# EAGLE design gy1 (EAGLE 9.2.2)

## Sheet 1 of 4
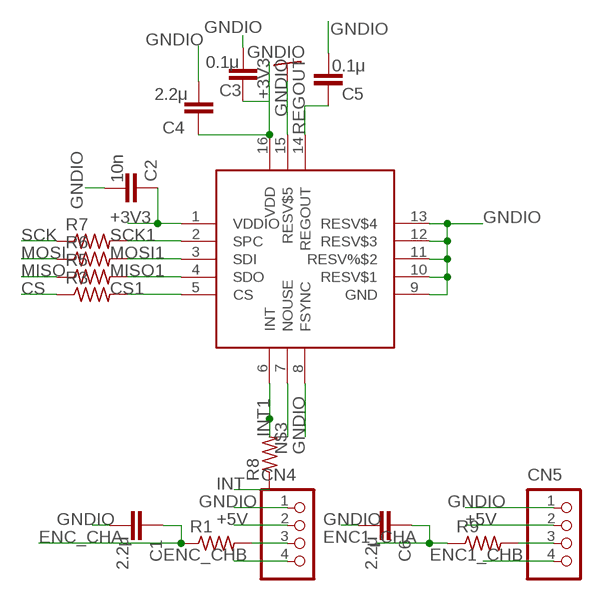
[diagram p0: schematic, sheet 1]

### Parts
C1  2.2μ  C-EUC0603  [C0603]
C2  10n  C-EUC0603  [C0603]
C3  0.1μ  C-EUC0603  [C0603]
C4  2.2μ  C-EUC0603  [C0603]
C5  0.1μ  C-EUC0603  [C0603]
C6  2.2μ  C-EUC0603  [C0603]
CN4  S4B-XASK-1  [S4B-XASK-1]
CN5  S4B-XASK-1  [S4B-XASK-1]
R1  R-US_R0603  [R0603]
R3  R-US_R0603  [R0603]
R5  R-US_R0603  [R0603]
R6  R-US_R0603  [R0603]
R7  R-US_R0603  [R0603]
R8  R-US_R0603  [R0603]
R9  R-US_R0603  [R0603]
U$1  ICM20602  [QFN50P300X300X80-16N]

### Nets
+3V3: C2.1 C3.1 C4.1 U$1.1(VDDIO) U$1.16(VDD) ; also sheet 2,3
+5V: CN4.2 CN5.2 ; also sheet 2,3,4
CS: R3.1 ; also sheet 2
CS1: R3.2 U$1.5(CS)
ENC1_CHA: C6.1 R9.1 ; also sheet 2
ENC1_CHB: CN5.4 ; also sheet 2
ENC_CHA: C1.1 R1.1 ; also sheet 2
ENC_CHB: CN4.4 ; also sheet 2
GNDIO: C1.2 C2.2 C3.2 C4.2 C5.2 C6.2 CN4.1 CN5.1 U$1.8(FSYNC) U$1.9(GND) U$1.10(RESV$1) U$1.11(RESV%$2) U$1.12(RESV$3) U$1.13(RESV$4) U$1.15(RESV$5) ; also sheet 2,3,4
INT: R8.1
INT1: R8.2 U$1.6(INT)
MISO: R5.1 ; also sheet 2
MISO1: R5.2 U$1.4(SDO)
MOSI: R6.1 ; also sheet 2
MOSI1: R6.2 U$1.3(SDI)
N$3: U$1.7(NOUSE)
N$4: CN4.3 R1.2
N$5: CN5.3 R9.2
REGOUT: C5.1 U$1.14(REGOUT)
SCK: R7.1 ; also sheet 2
SCK1: R7.2 U$1.2(SPC)

## Sheet 2 of 4
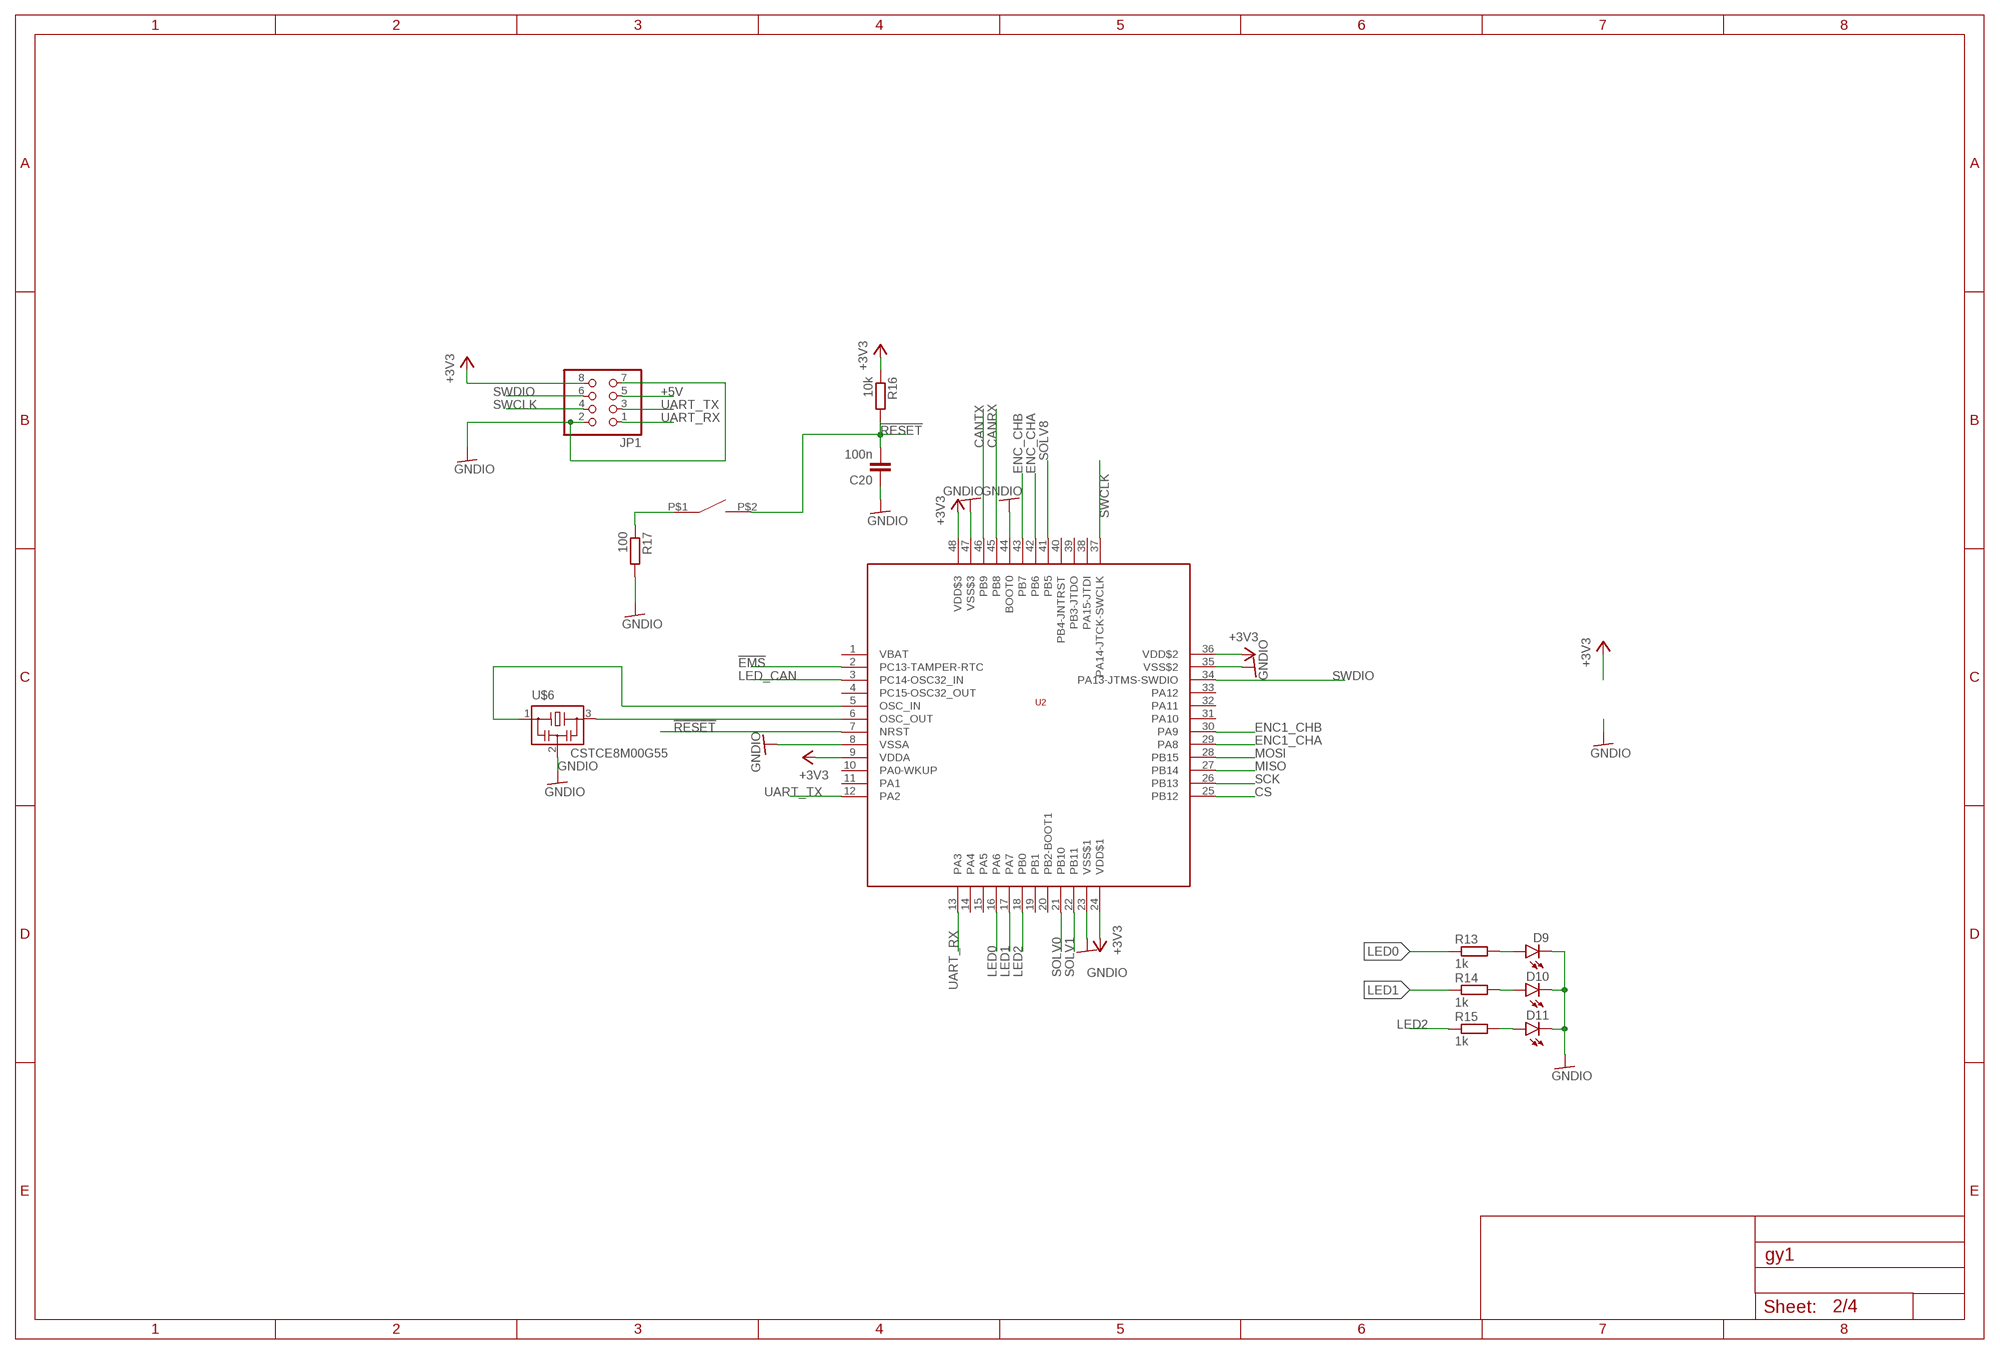
[diagram p1: schematic, sheet 2]

### Parts
C20  100n  C-EUC0603  [C0603]
D9  LEDCHIPLED_0805  [CHIPLED_0805]
D10  LEDCHIPLED_0805  [CHIPLED_0805]
D11  LEDCHIPLED_0805  [CHIPLED_0805]
JP1  PINHD-2X4  [2X04]
R13  1k  R-EU_R0603  [R0603]
R14  1k  R-EU_R0603  [R0603]
R15  1k  R-EU_R0603  [R0603]
R16  10k  R-EU_R0603  [R0603]
R17  100  R-EU_R0603  [R0603]
SW1  SWITCH_TACTILETOP  [SWITCH_TACTILE_3X6]
U2  STM32F103C8  [LQFP48]
U$6  CSTCE8M00G55  [CSTCE8M00G55]

### Nets
!EMS: U2.2(PC13-TAMPER-RTC)
!RESET: C20.2 R16.2 SW1.P$2 U2.7(NRST)
+3V3: JP1.8 R16.1 U2.9(VDDA) U2.24(VDD$1) U2.36(VDD$2) U2.48(VDD$3) ; also sheet 1,3
+5V: JP1.5 ; also sheet 1,3,4
CANRX: U2.45(PB8) ; also sheet 4
CANTX: U2.46(PB9) ; also sheet 4
CS: U2.25(PB12) ; also sheet 1
ENC1_CHA: U2.29(PA8) ; also sheet 1
ENC1_CHB: U2.30(PA9) ; also sheet 1
ENC_CHA: U2.42(PB6) ; also sheet 1
ENC_CHB: U2.43(PB7) ; also sheet 1
GNDIO: C20.1 D9.C D10.C D11.C JP1.2 JP1.7 R17.2 U2.8(VSSA) U2.23(VSS$1) U2.35(VSS$2) U2.44(BOOT0) U2.47(VSS$3) U$6.2 ; also sheet 1,3,4
LED0: R13.1 U2.16(PA6)
LED1: R14.1 U2.17(PA7)
LED2: R15.1 U2.18(PB0)
LED_CAN: U2.3(PC14-OSC32_IN) ; also sheet 4
MISO: U2.27(PB14) ; also sheet 1
MOSI: U2.28(PB15) ; also sheet 1
N$2: D10.A R14.2
N$10: D9.A R13.2
N$11: U2.6(OSC_OUT) U$6.3
N$16: R17.1 SW1.P$1
N$19: U2.5(OSC_IN) U$6.1
N$21: D11.A R15.2
SCK: U2.26(PB13) ; also sheet 1
SOLV0: U2.21(PB10)
SOLV1: U2.22(PB11)
SOLV8: U2.41(PB5)
SWCLK: JP1.4 U2.37(PA14-JTCK-SWCLK)
SWDIO: JP1.6 U2.34(PA13-JTMS-SWDIO)
UART_RX: JP1.1 U2.13(PA3)
UART_TX: JP1.3 U2.12(PA2)
Unconnected: U2.1(VBAT) U2.4(PC15-OSC32_OUT) U2.10(PA0-WKUP) U2.11(PA1) U2.14(PA4) U2.15(PA5) U2.19(PB1) U2.20(PB2-BOOT1) U2.31(PA10) U2.32(PA11) U2.33(PA12) U2.38(PA15-JTDI) U2.39(PB3-JTDO) U2.40(PB4-JNTRST)

## Sheet 3 of 4
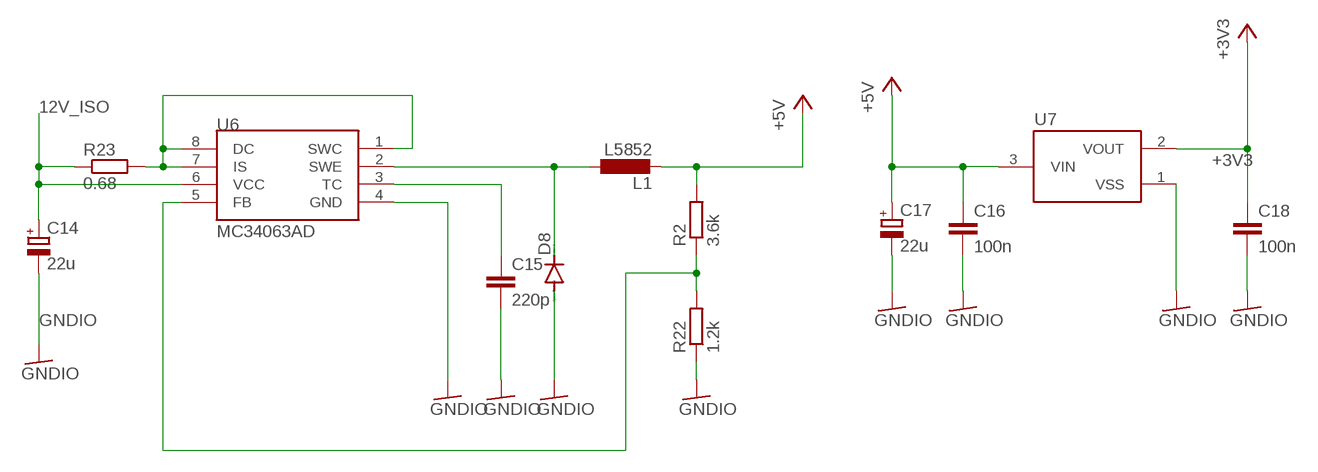
[diagram p2: schematic, sheet 3]

### Parts
C14  22u  CPOL-EUE2-5  [E2-5]
C15  220p  C-EUC0603  [C0603]
C16  100n  C-EUC0603  [C0603]
C17  22u  CPOL-EUE2-5  [E2-5]
C18  100n  C-EUC0603  [C0603]
D8  DIODE-SOD123  [SOD123]
L1  L5852  [L5852]
R2  3.6k  R-EU_R0603  [R0603]
R22  1.2k  R-EU_R0603  [R0603]
R23  0.68  R-EU_R1206  [R1206]
U6  MC34063AD  [SOIC8]
U7  XC6206  [SOT95P240X110-3]

### Nets
12V_ISO: C14.+ R23.1 U6.6(VCC) ; also sheet 4
+3V3: C18.1 U7.2(VOUT) ; also sheet 1,2
+5V: C16.1 C17.+ L1.P$2 R2.2 U7.3(VIN) ; also sheet 1,2,4
GNDIO: C14.- C15.2 C16.2 C17.- C18.2 D8.A R22.1 U6.4(GND) U7.1(VSS) ; also sheet 1,2,4
N$22: R23.2 U6.1(SWC) U6.7(IS) U6.8(DC)
N$24: D8.C L1.P$1 U6.2(SWE)
N$25: C15.1 U6.3(TC)
N$26: R2.1 R22.2 U6.5(FB)

## Sheet 4 of 4
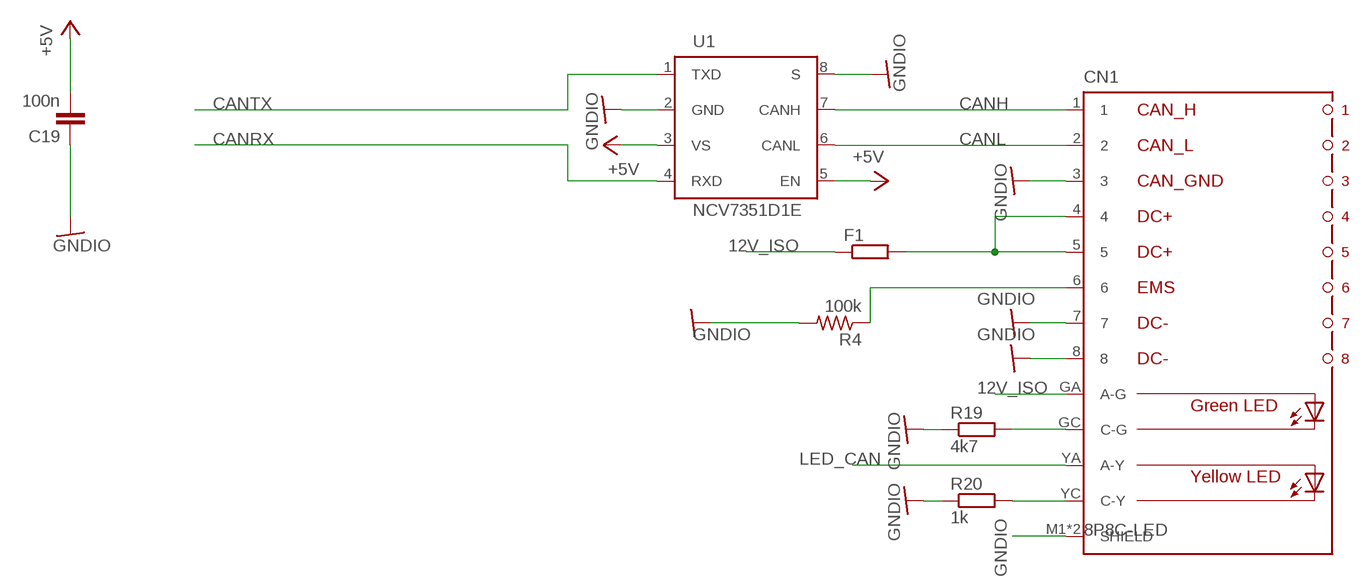
[diagram p3: schematic, sheet 4]

### Parts
C19  100n  C-EUC0603  [C0603]
CN1  8P8C-LED  [8P8C-LED]
F1  R-EU_R1206  [R1206]
R4  100k  R-US_R0603  [R0603]
R19  4k7  R-EU_R0603  [R0603]
R20  1k  R-EU_R0603  [R0603]
U1  NCV7351D1E  [SO08]

### Nets
12V_ISO: CN1.GA(A-G) F1.1 ; also sheet 3
+5V: C19.2 U1.3(VS) U1.5(EN) ; also sheet 1,2,3
CANH: CN1.1 U1.7(CANH)
CANL: CN1.2 U1.6(CANL)
CANRX: U1.4(RXD) ; also sheet 2
CANTX: U1.1(TXD) ; also sheet 2
GNDIO: C19.1 CN1.3 CN1.7 CN1.8 CN1.M1(SHIELD) CN1.M2(SHIELD) R4.2 R19.1 R20.1 U1.2(GND) U1.8(S) ; also sheet 1,2,3
LED_CAN: CN1.YA(A-Y) ; also sheet 2
N$1: CN1.GC(C-G) R19.2
N$12: CN1.4 CN1.5 F1.2
N$18: CN1.YC(C-Y) R20.2
N$38: CN1.6 R4.1

## Library data of the parts
C1-C6 C16 C18-C20 = rcl:C-EU: CAPACITOR, European symbol
C14 C17 = rcl:CPOL-EU: POLARIZED CAPACITOR, European symbol
C15 = rcl:C-EU: CAPACITOR, European symbol; SPICEPREFIX: C
CN1 = con-rj45:8P8C-LED: generic 8P8C connector with two LED's; OC_FARNELL: unknown; OC_NEWARK: unknown
CN4 CN5 = jst-xa:S4B-XASK-1: Wire-to-Board 2.5mm pitch top mount connector Source: http://www.jst-mfg.com/product/pdf/jpn/XA1.pdf http://www.jst-mfg.com/product/detail.php?series=272
D8 = diode:DIODE-: DIODE
D9-D11 = led:LED: LED OSRAM: - CHIPLED LG R971, LG N971, LY N971, LG Q971, LY Q971, LO R971, LY R971 LH N974, LH R974 LS Q976, LO Q976, LY Q976 LO Q996 - Hyper CHIPLED LW Q18S LB Q993, LB Q99A, LB R99A - SideLED LS A670, LO A670, LY A670, LG A670, LP A670 LB A673, LV A673, LT A673, LW A673 LH A674 LY A675 LS A676, LA A676, LO A676, LY A676, LW A676 LS A679, LY A679, LG A679 - Hyper Micro SIDELED® LS Y876, LA Y876, LO Y876, LY Y876 LT Y87S - SmartLED LW L88C, LW L88S LB L89C, LB L89S, LG L890 LS L89K, LO L89K, LY L89K LS L896, LA L896, LO L896, LY L896 - TOPLED LS T670, LO T670, LY T670, LG T670, LP T670 LSG T670, LSP T670, LSY T670, LOP T670, LYG T670 LG T671, LOG T671, LSG T671 LB T673, LV T673, LT T673, LW T673 LH T674 LS T676, LA T676, LO T676, LY T676, LB T676, LH T676, LSB T676, LW T676 LB T67C, LV T67C, LT T67C, LS T67K, LO T67K, LY T67K, LW E67C LS E67B, LA E67B, LO E67B, LY E67B, LB E67C, LV E67C, LT E67C LW T67C LS T679, LY T679, LG T679 LS T770, LO T770, LY T770, LG T770, LP T770 LB T773, LV T773, LT T773, LW T773 LH T774 LS E675, LA E675, LY E675, LS T675 LS T776, LA T776, LO T776, LY T776, LB T776 LHGB T686 LT T68C, LB T68C - Hyper Mini TOPLED® LB M676 - Mini TOPLED Santana® LG M470 LS M47K, LO M47K, LY M47K Source: http://www.osram.convergy.de LUXEON: - LUMILED® LXK2-PW12-R00, LXK2-PW12-S00, LXK2-PW14-U00, LXK2-PW14-V00 LXK2-PM12-R00, LXK2-PM12-S00, LXK2-PM14-U00 LXK2-PE12-Q00, LXK2-PE12-R00, LXK2-PE12-S00, LXK2-PE14-T00, LXK2-PE14-U00 LXK2-PB12-K00, LXK2-PB12-L00, LXK2-PB12-M00, LXK2-PB14-N00, LXK2-PB14-P00, LXK2-PB14-Q00 LXK2-PR12-L00, LXK2-PR12-M00, LXK2-PR14-Q00, LXK2-PR14-R00 LXK2-PD12-Q00, LXK2-PD12-R00, LXK2-PD12-S00 LXK2-PH12-R00, LXK2-PH12-S00 LXK2-PL12-P00, LXK2-PL12-Q00, LXK2-PL12-R00 Source: www.luxeon.com KINGBRIGHT: KA-3528ASYC Source: www.kingbright.com
F1 R2 R19 R20 R22 R23 = rcl:R-EU_: RESISTOR, European symbol; SPICEPREFIX: R
JP1 = pinhead:PINHD-2X4: PIN HEADER
L1 = l_ysk:L5852
R1 R3-R9 = rcl:R-US_: RESISTOR, American symbol; SPICEPREFIX: R
R13-R17 = rcl:R-EU_: RESISTOR, European symbol
SW1 = switch-tactile:SWITCH_TACTILE
U1 = on-semi:NCV7351D1E: High Speed CAN Transceiver Source: NCV7351-D.PDF <http://www.onsemi.com/PowerSolutions/document/NCV7351-D.PDF>
U2 = stm32_mcu:STM32F103C8: STMicroelectronics STM32F103C8 Mainstream Performance line, ARM Cortex-M3 MCU with 64 Kbytes Flash, 72 MHz CPU, motor control, USB and CAN references: datasheet <https://www.st.com/resource/en/datasheet/stm32f103c8.pdf> product page <https://www.st.com/ja/microcontrollers/stm32f103c8.html>
U6 = mc34063:MC34063
U7 = torex:XC6206
U$1 = ICM20602:ICM20602
U$6 = resonator:CSTCE8M00G55

## Board
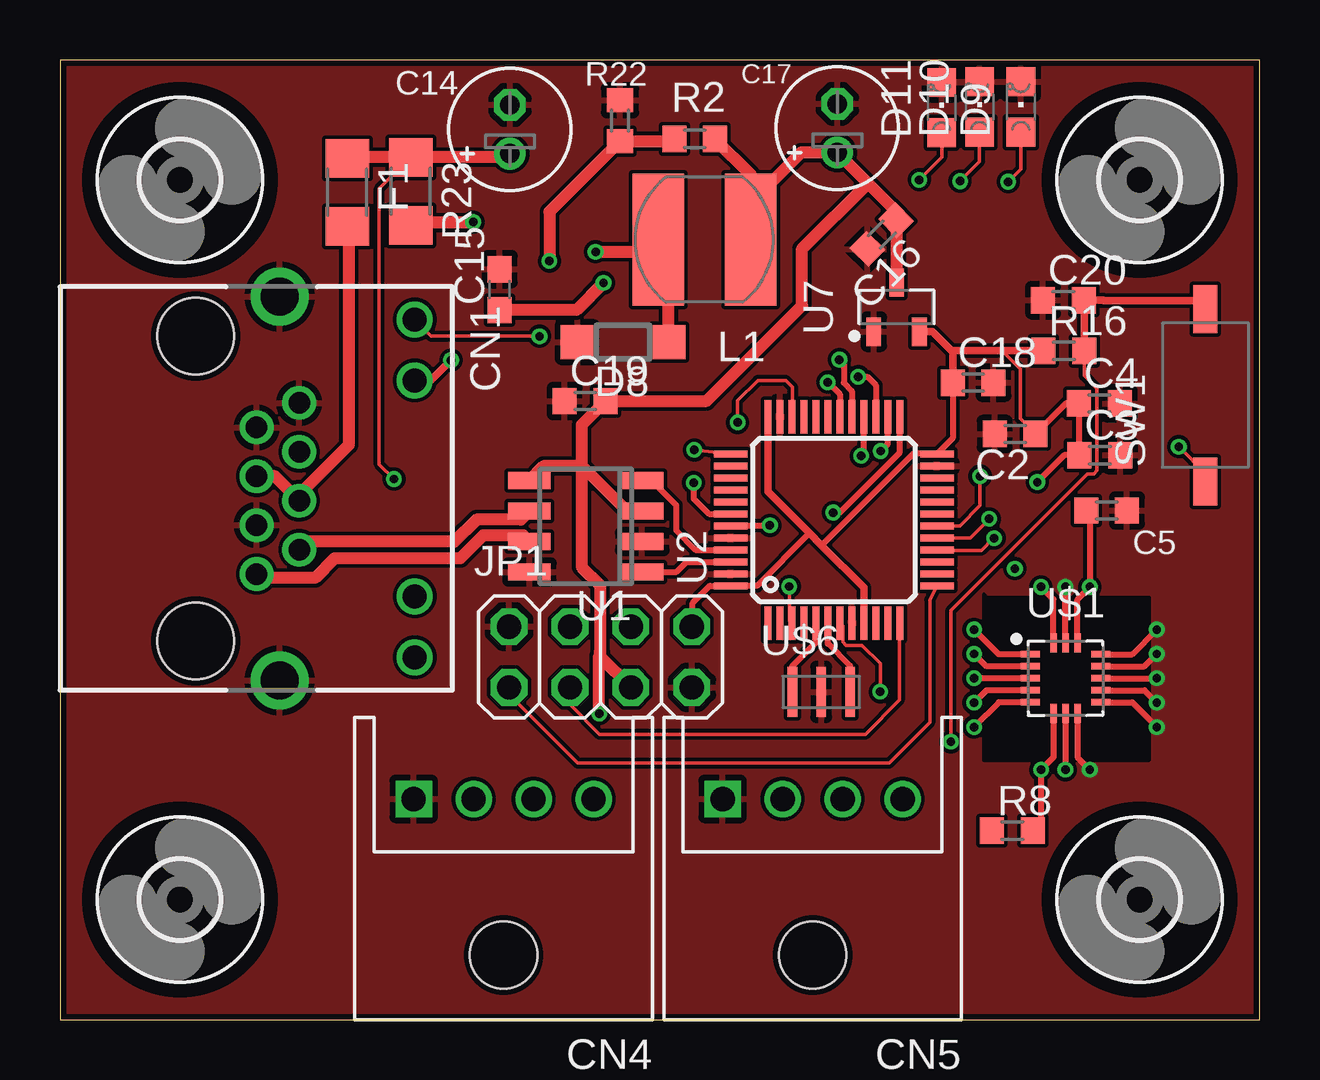
[diagram p4: board, top side]
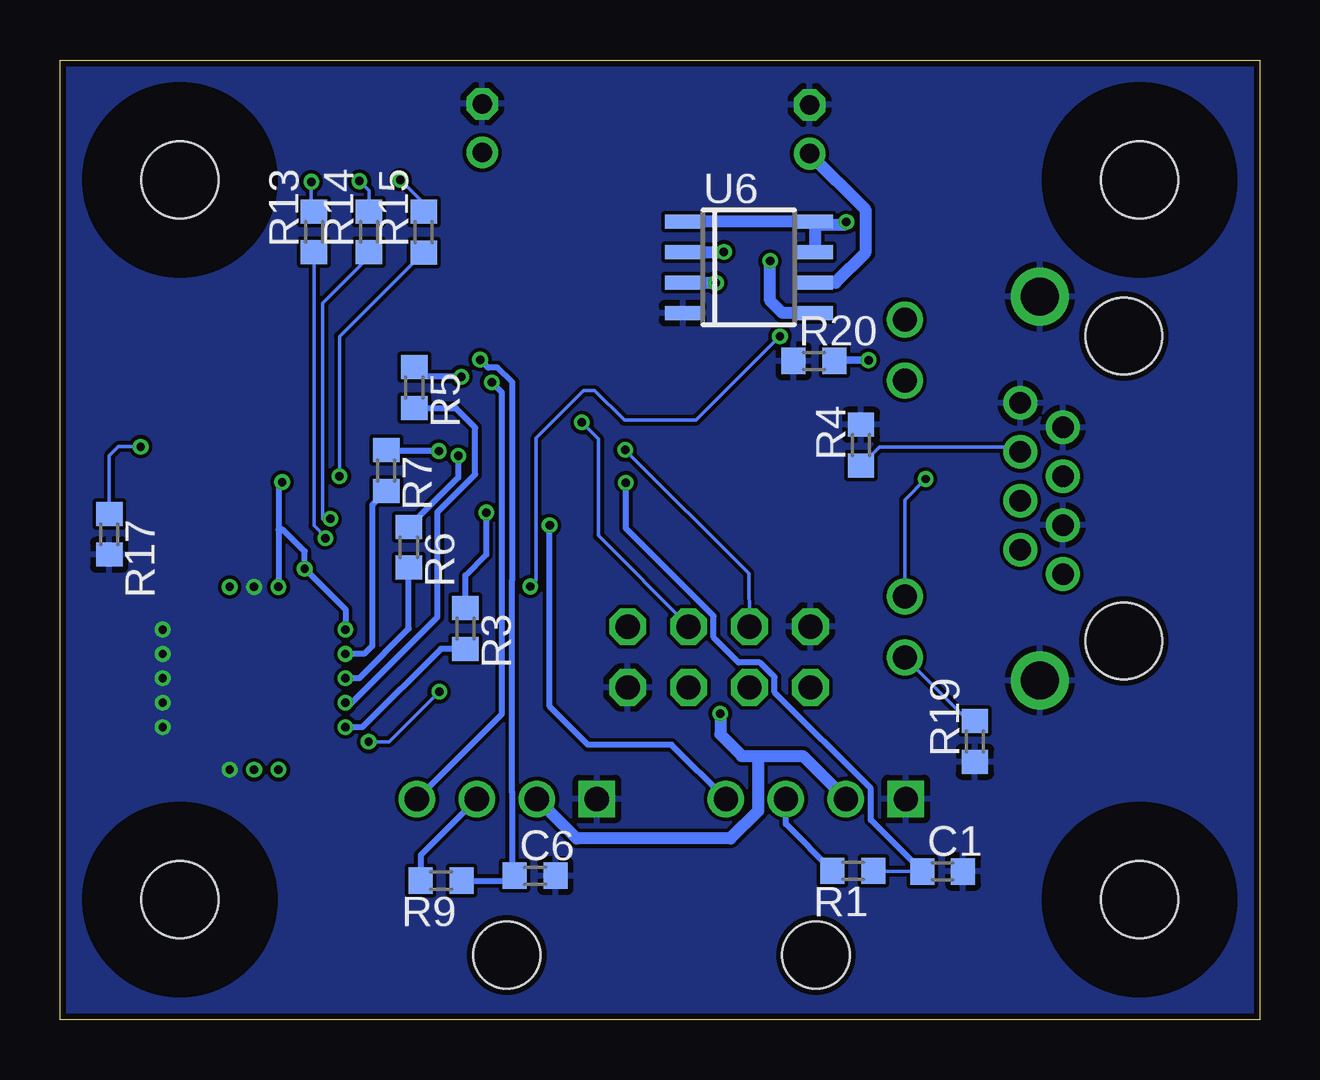
[diagram p5: board, bottom side, seen from below]

Size 50 x 40 mm. Coordinates in mm from the lower left corner, seen from the top.
Outline: 0,0 50,0 50,40 0,40 0,0
Copper layers (1*16): Top 0.035mm / dielectric 1.5mm / Bottom 0.035mm
Design rules "SeeedStudio_2layer_DRU_no_angle_20140221": minimum track width 6mil, minimum drill 12mil, track to track 6mil, track to pad 6mil, pad to pad 6mil, via to via 6mil, smd to smd 0mil, copper to edge 10mil, drill to drill 10mil, minimum pad ring 10mil, minimum via ring 6mil, stop-mask expansion 2mil, vias tented up to drill 100mil, thermal gap 10mil

### Footprints (pad centres in the part's own frame; a part is rotated, then mirrored left to right if it is on the bottom)
C0603 = smd 1 x 1.1: 1 -0.85,0; 2 0.85,0
E2-5 = drill 0.813 pad 1.27: + -1.016,0 | drill 0.813 pad 1.27 octagon: - 1.016,0
C0603' = smd 1.1 x 1: 1 -0.85,0; 2 0.85,0
8P8C-LED = drill 0.9 pad 1.3: 1 3.57,-3.81; 2 2.55,-2.03; 3 1.53,-3.81; 4 0.51,-2.03; 5 -0.51,-3.81; 6 -1.53,-2.03; 7 -2.55,-3.81; 8 -3.57,-2.03 | drill 1 pad 1.422: GA 4.5,2.78; GC 7.04,2.78; YA -7.04,2.78; YC -4.5,2.78 | drill 1.6 pad 2.184: M1 -8,-2.85; M2 8,-2.85 | hole 3.2: 6.35,-6.35; -6.35,-6.35
S4B-XASK-1 = drill 1.016 square: 1 3.75,0 | drill 1.016: 2 1.25,0; 3 -1.25,0; 4 -3.75,0 | hole 2.8: 0,6.5
SOD123 = smd 1.4 x 1.4: A 1.9,0; C -1.9,0
CHIPLED_0805 = smd 1.2 x 1.2: A 0,-1.05; C 0,1.05
R1206 = smd 1.6 x 1.803: 1 -1.422,0; 2 1.422,0
2X04 = drill 1.016 octagon: 1 -3.81,-1.27; 2 -3.81,1.27; 3 -1.27,-1.27; 4 -1.27,1.27; 5 1.27,-1.27; 6 1.27,1.27; 7 3.81,-1.27; 8 3.81,1.27
L5852 = smd 2.15 x 5.5: P$1 1.925,0; P$2 -1.925,0
R0603 = smd 1 x 1.1: 1 -0.85,0; 2 0.85,0
SWITCH_TACTILE_3X6 = smd 2 x 1: P$1 -3.6,0; P$2 3.6,0
SO08 = smd 0.72 x 1.78: 1 -1.905,-2.35; 2 -0.635,-2.35; 3 0.635,-2.35; 4 1.905,-2.35; 5 1.905,2.35; 6 0.635,2.35; 7 -0.635,2.35; 8 -1.905,2.35
LQFP48 = smd 1.4 x 0.3: 1 -4.3,2.75; 2 -4.3,2.25; 3 -4.3,1.75; 4 -4.3,1.25; 5 -4.3,0.75; 6 -4.3,0.25; 7 -4.3,-0.25; 8 -4.3,-0.75; 9 -4.3,-1.25; 10 -4.3,-1.75; 11 -4.3,-2.25; 12 -4.3,-2.75; 25 4.3,-2.75; 26 4.3,-2.25; 27 4.3,-1.75; 28 4.3,-1.25; 29 4.3,-0.75; 30 4.3,-0.25; 31 4.3,0.25; 32 4.3,0.75; 33 4.3,1.25; 34 4.3,1.75; 35 4.3,2.25; 36 4.3,2.75 | smd 0.3 x 1.4: 13 -2.75,-4.3; 14 -2.25,-4.3; 15 -1.75,-4.3; 16 -1.25,-4.3; 17 -0.75,-4.3; 18 -0.25,-4.3; 19 0.25,-4.3; 20 0.75,-4.3; 21 1.25,-4.3; 22 1.75,-4.3; 23 2.25,-4.3; 24 2.75,-4.3; 37 2.75,4.3; 38 2.25,4.3; 39 1.75,4.3; 40 1.25,4.3; 41 0.75,4.3; 42 0.25,4.3; 43 -0.25,4.3; 44 -0.75,4.3; 45 -1.25,4.3; 46 -1.75,4.3; 47 -2.25,4.3; 48 -2.75,4.3
SOIC8 = smd 0.6 x 1.5: 1 -1.905,-2.75; 2 -0.635,-2.75; 3 0.635,-2.75; 4 1.905,-2.75; 5 1.905,2.75; 6 0.635,2.75; 7 -0.635,2.75; 8 -1.905,2.75
SOT95P240X110-3 = smd 1.18 x 0.609: 1 -1.024,0.95; 2 -1.024,-0.95; 3 1.024,0
QFN50P300X300X80-16N = smd 0.788 x 0.27: 1 -1.471,1; 2 -1.471,0.5; 3 -1.471,0; 4 -1.471,-0.5; 5 -1.471,-1; 9 1.471,-1; 10 1.471,-0.5; 11 1.471,0; 12 1.471,0.5; 13 1.471,1 | smd 0.27 x 0.788: 6 -0.5,-1.471; 7 0,-1.471; 8 0.5,-1.471; 14 0.5,1.471; 15 0,1.471; 16 -0.5,1.471
3,2 = hole 3.2: 0,0
CSTCE8M00G55 = smd 0.4 x 2.1: 1 -1.2,0; 2 0,0; 3 1.2,0

### Placement (x,y rotation side)
C1  13.21,6.17 0 bottom
C2  39.81,24.41 180 top
C3  43.35,23.52 0 top
C4  43.32,25.68 0 top
C5  43.62,21.22 0 top
C6  30.2,5.99 0 bottom
C14  18.76,37.11 90 top
C15  220p  [C0603']  18.33,30.42 90 top
C16  34.26,32.72 225 top
C17  32.4,37.16 90 top
C18  38.06,26.55 0 top
C19  21.89,25.78 0 top
C20  41.82,29.98 0 top
CN1  12,22.14 270 top
CN4  18.49,9.19 180 top
CN5  31.37,9.19 180 top
D8  23.47,28.24 180 top
D9  40.05,38.04 0 top
D10  38.33,38.04 0 top
D11  36.75,38.01 0 top
F1  11.98,34.48 270 top
JP1  22.53,15.11 0 top
L1  26.86,32.5 180 top
R1  16.94,6.2 180 bottom
R2  26.46,36.71 0 top
R3  33.1,16.31 270 bottom
R4  16.61,23.95 90 bottom
R5  35.23,26.34 270 bottom
R6  35.46,19.68 270 bottom
R7  36.4,22.89 270 bottom
R8  39.7,7.87 0 top
R9  34.11,5.79 180 bottom
R13  39.41,32.84 90 bottom
R14  37.12,32.83 90 bottom
R15  34.84,32.83 90 bottom
R16  41.84,27.88 0 top
R17  47.95,20.23 270 bottom
R19  11.86,11.6 90 bottom
R20  18.58,27.45 0 bottom
R22  23.34,37.47 270 top
R23  14.62,34.52 270 top
SW1  47.74,26.02 90 top
U1  21.92,20.56 90 top
U2  32.26,20.83 90 top
U6  21.29,31.35 270 bottom
U7  34.87,29.7 90 top
U$1  41.91,14.22 0 top
U$2  [3,2]  5,35 0 top
U$3  [3,2]  5,5 0 top
U$4  [3,2]  45,5 0 top
U$5  [3,2]  45,35 0 top
U$6  31.73,13.66 0 top

### Tracks (layer width: path | path; a pad name or v marks a point on that pad's centre or on a via)
12V_ISO  (via drill 0.35)
  Top 0.152: v13.92,22.53 13.31,23.14 13.31,34.63 R23.1
  Top 0.508: F1.1 12.02,35.94 R23.1 18.6,35.94 C14.+
  Bottom 0.152: CN1.GA 14.79,21.66 v13.92,22.53
  Bottom 0.508: C14.+ 16.43,33.77 16.43,31.95 17.67,30.72 U6.6
!RESET  (via drill 0.35)
  Top 0.152: v34.19,13.66 34.19,14.85 33.44,15.6 32.76,15.6 32.63,15.73 32.63,16.41 U2.7 | v37.13,11.58 37.13,17.04 42.83,22.74 43.09,22.74 43.22,22.88 43.22,26.3 42.69,26.84 R16.2
  Top 0.305: R16.2 42.69,29.96 C20.2 43.48,29.98 43.49,29.98 47.39,29.98 SW1.P$2
  Bottom 0.152: v34.19,13.66 36.27,11.58 v37.13,11.58
+3V3  (via drill 0.35)
  Top 0.152: 40.99,27.99 R16.1 | C2.1 40.03,25.05 40.03,27.11 39.26,27.88 39.06,27.88
  Top 0.254: U$1.1 39.13,15.22 v38.1,16.26 | U$1.16 41.41,17.52 v40.89,18.03 | C2.1 41.94,25.68 C4.1 42.47,23.55 C3.1 41.86,23.52 v40.74,22.4 | JP1.8 26.37,17.36 27.1,18.09 27.11,18.08 U2.48 29.04,18.08 31.24,20.27 | C18.1 37.21,24.23 U2.24 35.56,23.58 31.75,19.77
  Top 0.305: 37.15,27.88 36.36,28.67 U7.2 | 37.15,27.88 39.06,27.88 40.88,27.88 40.99,27.99 | C18.1 37.21,27.82 37.15,27.88 | U2.36 29.51,22 31.24,20.27 31.75,19.77 33.51,18 U2.9
  Bottom 0.254: v40.74,22.4 40.89,22.25 40.89,20.42 | 40.89,20.42 v40.89,18.03 | v38.1,16.26 38.1,17.09 v39.8,18.8 39.8,19.51 40.71,20.42 40.89,20.42
+5V  (via drill 0.35)
  Top 0.508: R2.2 28.78,35.23 28.78,34.04 | 28.78,34.04 L1.P$2 | 21.74,23.09 21.74,24.79 C19.2 26.95,25.78 30.94,29.77 30.94,32.13 33.67,34.87 | 21.74,23.09 21.74,23.06 | 21.74,23.06 20.16,23.06 U1.5 | 21.74,23.09 23.63,21.2 U1.3 | U7.3 34.86,30.74 C16.1 34.86,33.69 33.67,34.87 | JP1.5 22.53,15.1 | 22.53,15.1 22.48,15.15 v22.48,12.75 | 33.67,34.87 C17.+ 30.89,36.14 28.78,34.04 | 21.74,23.06 21.74,18.87 22.5,18.11 22.5,15.33 22.53,15.3 22.53,15.1
  Bottom 0.508: v22.48,12.75 22.48,11.89 21.57,10.99 20.91,10.99 | CN4.2 19.04,10.99 20.91,10.99 | 20.91,10.99 20.91,8.71 20.89,8.7 22.05,7.54 28.47,7.54 CN5.2
CANH
  Top 0.508: U1.7 19.31,20.18 17.64,20.18 16.69,19.24 11.46,19.24 10.63,18.41 8.35,18.41 CN1.1
CANL
  Top 0.508: CN1.2 10.3,19.92 16.44,19.92 17.36,20.84 19.21,20.84 U1.6
CANRX
  Top 0.254: U1.4 24.65,22.47 25.68,21.44 25.68,20.4 26.5,19.58 U2.45
CANTX
  Top 0.254: U1.1 25.69,18.66 26.11,19.08 U2.46
CS  (via drill 0.35)
  Top 0.254: v32.23,21.13 32.5,21.13 35.01,23.64 U2.25
  Bottom 0.254: R3.1 33.1,18.52 32.23,19.38 v32.23,21.13
CS1  (via drill 0.35)
  Top 0.254: U$1.5 39.13,13.22 v38.1,12.19
  Bottom 0.254: R3.2 34.12,15.46 37.39,12.19 v38.1,12.19
ENC1_CHA  (via drill 0.35)
  Top 0.254: U2.29 33.01,26.2 32.67,26.55 32.67,27.33 v32.49,27.51
  Bottom 0.254: R9.1 31.25,5.79 C6.1 31.16,6.1 31.16,9.47 31.15,9.48 31.15,18.33 31.14,18.34 31.14,26.57 31.75,27.18 32.15,27.18 v32.49,27.51
ENC1_CHB  (via drill 0.35)
  Top 0.254: v32,26.57 32.51,26.06 U2.30
  Bottom 0.254: v32,26.57 31.57,26.14 31.57,12.74 CN5.4
ENC_CHA  (via drill 0.35)
  Top 0.254: v26.42,22.38 26.42,21.72 27.05,21.08 U2.42
  Bottom 0.152: C1.1 16.07,6.17 R1.1
  Bottom 0.254: C1.1 16.2,8.31 16.2,9.63 20.22,13.64 20.22,14.27 20.83,14.88 21.71,14.88 22.76,15.93 22.76,16.81 26.42,20.47 v26.42,22.38
ENC_CHB  (via drill 0.35)
  Top 0.152: U2.43 27.98,20.6
  Top 0.254: 27.98,20.6 v29.59,20.6
  Bottom 0.254: CN4.4 24.5,11.46 27.99,11.46 29.59,13.06 v29.59,20.6
GNDIO  (via drill 0.35)
  Top 0.254: U$1.13 44.69,15.22 v45.72,16.26 | U$1.12 45.2,14.72 v45.72,15.24 | U$1.11 v45.72,14.22 | U$1.10 45.2,13.72 v45.72,13.21 | U$1.9 44.69,13.22 v45.72,12.19 | U$1.15 v41.91,18.03 | U$1.8 42.41,10.93 v42.93,10.41
  pour Bottom: -0.43,41.07 -0.69,40.82 -0.69,-1.37 51.13,-1.37 51.49,-1.73 51.49,40.28 51.05,40.72 -0.08,40.72
  pour Top: -0.25,40.23 -0.25,-0.25 -0.28,-0.28 50.44,-0.28 50.5,-0.33 50.5,40.18 50.44,40.23
INT1  (via drill 0.35)
  Top 0.254: U$1.6 41.41,10.93 v40.89,10.41 40.89,8.22 R8.2
LED0  (via drill 0.35)
  Top 0.152: v38.94,20.07 38.91,20.07 38.4,19.56 36.58,19.56 U2.16
  Bottom 0.152: R13.1 39.41,20.59 38.94,20.12 v38.94,20.07
LED1  (via drill 0.35)
  Top 0.152: v38.73,20.87 37.94,20.08 U2.17
  Bottom 0.152: R14.1 37.12,31.8 39.05,29.87 39.05,20.87 v38.73,20.87
LED2  (via drill 0.35)
  Top 0.152: v38.35,22.65 38.35,21.43 37.51,20.58 U2.18
  Bottom 0.152: R15.1 38.35,28.47 v38.35,22.65
LED_CAN  (via drill 0.35)
  Top 0.152: CN1.YA 15.48,28.48 v19.99,28.48 | U2.3 30.4,16.64 v30.4,18.05
  Bottom 0.152: v19.99,28.48 23.5,24.98 26.48,24.98 27.71,26.21 28.17,26.21 30.15,24.23 30.15,18.3 v30.4,18.05
MISO  (via drill 0.35)
  Top 0.254: v33.27,26.8 33.66,26.8 34.01,26.44 U2.27
  Bottom 0.254: R5.1 34.84,26.8 v33.27,26.8
MISO1  (via drill 0.35)
  Top 0.254: U$1.4 38.62,13.72 v38.1,13.21
  Bottom 0.254: v38.1,13.21 37.85,13.21 34.27,16.79 34.27,21.15 32.69,22.73 32.69,24.68 33.5,25.49 R5.2
MOSI  (via drill 0.35)
  Top 0.254: v33.4,23.5 33.51,23.6 U2.28
  Bottom 0.254: R6.1 33.4,22.59 v33.4,23.5
MOSI1  (via drill 0.35)
  Top 0.254: U$1.3 v38.1,14.22
  Bottom 0.254: v38.1,14.22 38.09,14.24 37.52,14.24 35.46,16.3 R6.2
N$1
  Bottom 0.152: CN1.GC 12.13,12.45 R19.2
N$2  (via drill 0.35)
  Top 0.152: v37.52,34.95 38.33,35.77 D10.A
  Bottom 0.152: v37.52,34.95 37.12,34.56 R14.2
N$3  (via drill 0.35)
  Top 0.254: U$1.7 v41.91,10.41
N$4
  Bottom 0.254: R1.2 19.74,8.15 CN4.3
N$5
  Bottom 0.254: CN5.3 34.96,6.85 R9.2
N$10  (via drill 0.35)
  Top 0.152: v39.52,34.92 40.05,35.45 D9.A
  Bottom 0.152: v39.52,34.92 39.52,33.8 R13.2
N$11
  Top 0.254: U$6.3 32.93,14.74 32,15.67 U2.6
N$12
  Top 0.508: F1.2 12.04,32.99 12.04,23.95 9.97,21.89 CN1.4 8.96,22.65 CN1.5
N$16  (via drill 0.35)
  Top 0.152: SW1.P$1 47.74,22.77 v46.63,23.88
  Bottom 0.152: v46.63,23.88 47.57,23.88 47.95,23.5 R17.1
N$18  (via drill 0.35)
  Top 0.305: v16.3,27.48 15.45,26.64 CN1.YC
  Bottom 0.305: R20.2 17.7,27.48 v16.3,27.48
N$19
  Top 0.254: U2.5 31.51,15.71 30.53,14.73 U$6.1
N$21  (via drill 0.35)
  Top 0.152: v35.81,35 36.75,35.94 D11.A
  Bottom 0.152: v35.81,35 34.84,34.02 R15.2
N$22  (via drill 0.35)
  Top 0.508: R23.2 15.05,33.52 15.35,33.22 17.2,33.22 v17.22,33.25
  Bottom 0.508: U6.8 18.41,33.13 17.31,33.13 17.22,33.22 v17.22,33.25 | U6.8 U6.7 | U6.8 U6.1
N$24  (via drill 0.35)
  Top 0.508: v22.33,32 24.43,32 L1.P$1 25.37,32.07 D8.C
  Bottom 0.508: U6.2 22.34,31.99 v22.33,32
N$25  (via drill 0.35)
  Top 0.508: v22.66,30.71 21.52,29.57 C15.1
  Bottom 0.508: U6.3 v22.67,30.72 v22.66,30.71
N$26  (via drill 0.35)
  Top 0.508: v20.4,31.62 20.4,33.67 R22.2 25.52,36.62 R2.1
  Bottom 0.508: U6.5 19.88,29.45 20.4,29.97 v20.4,31.62
N$38
  Bottom 0.152: R4.1 15.85,23.86 10.17,23.86 CN1.6
NOCONNECT
  cutout Top: 38.51,17.73 38.51,10.79 45.39,10.79 45.42,10.82 45.42,17.6 38.63,17.6
REGOUT  (via drill 0.35)
  Top 0.254: U$1.14 42.41,17.52 v42.93,18.03 42.93,21.07 C5.1
SCK  (via drill 0.35)
  Top 0.254: v34.21,23.7 34.51,24 U2.26
  Bottom 0.254: R7.1 36.36,23.7 v34.21,23.7
SCK1  (via drill 0.35)
  Top 0.254: U$1.2 38.62,14.72 v38.1,15.24
  Bottom 0.254: v38.1,15.24 37.31,15.24 36.98,15.57 36.98,21.45 R7.2
SWCLK  (via drill 0.35)
  Top 0.152: v26.44,23.75 26.46,23.73 U2.37
  Bottom 0.152: JP1.4 21.29,18.59 v26.44,23.75
SWDIO  (via drill 0.35)
  Top 0.152: U2.34 30.54,25.16 30.54,26.35 30.25,26.64 29.09,26.64 28.25,25.8 v28.25,24.89
  Bottom 0.152: v28.25,24.89 27.56,24.21 27.56,20.17 23.8,16.41 JP1.6
UART_RX
  Top 0.152: JP1.1 18.72,13.55 21.57,10.69 34.57,10.69 36.26,12.38 36.26,17.49 U2.13
UART_TX
  Top 0.152: JP1.3 21.29,13.08 22.49,11.89 33.56,11.89 34.99,13.31 34.99,16.51 U2.12